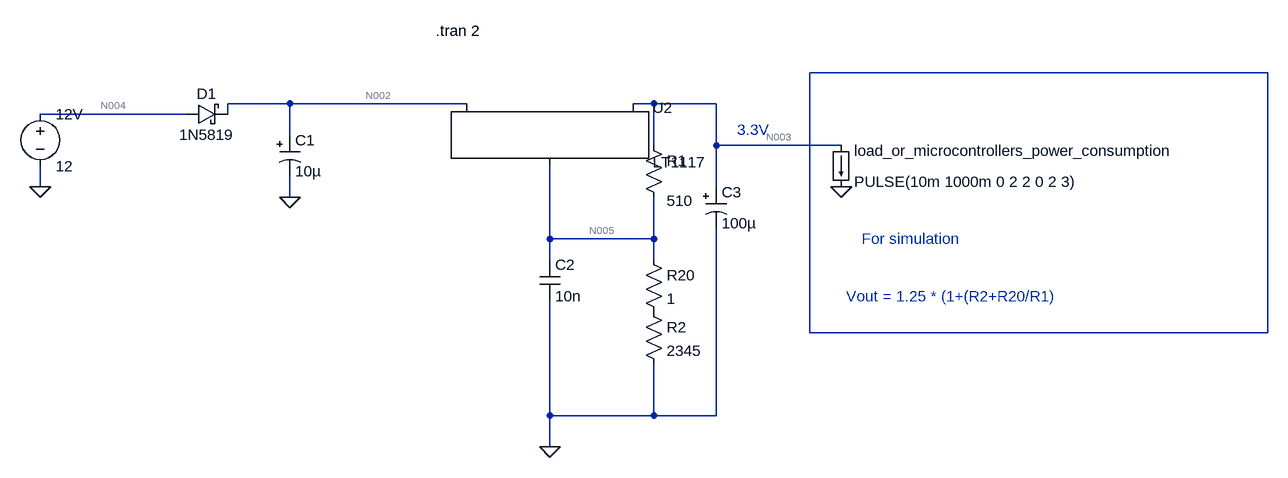
[diagram p0: schematic STM32 power.asc]
STM32 power.asc, the LTspice schematic file:
Version 4
SHEET 1 956 740
WIRE -272 16 -976 16
WIRE -1776 64 -1872 64
WIRE -1504 64 -1776 64
WIRE -1216 64 -1248 64
WIRE -1120 64 -1216 64
WIRE -1936 80 -2160 80
WIRE -1872 80 -1872 64
WIRE -1776 112 -1776 64
WIRE -1216 128 -1216 64
WIRE -1120 128 -1120 64
WIRE -928 128 -1120 128
WIRE -2160 192 -2160 160
WIRE -1120 192 -1120 128
WIRE -1776 208 -1776 176
WIRE -1376 272 -1376 160
WIRE -1216 272 -1216 208
WIRE -1216 272 -1376 272
WIRE -1376 304 -1376 272
WIRE -1216 304 -1216 272
WIRE -976 416 -976 16
WIRE -272 416 -272 16
WIRE -272 416 -976 416
WIRE -1376 544 -1376 368
WIRE -1216 544 -1216 464
WIRE -1216 544 -1376 544
WIRE -1120 544 -1120 256
WIRE -1120 544 -1216 544
WIRE -1376 592 -1376 544
FLAG -1376 592 0
FLAG -2160 192 0
FLAG -928 192 0
FLAG -1776 208 0
SYMBOL PowerProducts\\LT1117 -1376 64 R0
SYMATTR InstName U2
SYMBOL voltage -2160 64 R0
WINDOW 123 0 0 Left 0
WINDOW 39 0 0 Left 0
SYMATTR InstName 12V
SYMATTR Value 12
SYMBOL res -1232 112 R0
WINDOW 3 36 101 Left 2
SYMATTR Value 510
SYMATTR InstName R1
SYMATTR SpiceLine tol=0
SYMBOL cap -1392 304 R0
SYMATTR InstName C2
SYMATTR Value 10n
SYMBOL load -944 128 R0
WINDOW 123 0 0 Left 0
WINDOW 39 0 0 Left 0
SYMATTR InstName load_or_microcontrollers_power_consumption
SYMATTR Value PULSE(10m 1000m 0 2 2 0 2 3)
SYMBOL res -1232 288 R0
SYMATTR InstName R20
SYMATTR Value 1
SYMATTR SpiceLine tol=0
SYMBOL res -1232 368 R0
SYMATTR InstName R2
SYMATTR Value 2345
SYMATTR SpiceLine tol=0
SYMBOL schottky -1936 96 R270
WINDOW 0 32 32 VTop 2
WINDOW 3 0 32 VBottom 2
SYMATTR InstName D1
SYMATTR Value 1N5819
SYMATTR Description Diode
SYMATTR Type diode
SYMBOL polcap -1792 112 R0
WINDOW 3 24 56 Left 2
SYMATTR Value 10µ
SYMATTR InstName C1
SYMATTR Description Capacitor
SYMATTR Type cap
SYMATTR SpiceLine V=16 Irms=540m Rser=0.24 Lser=4.5n
SYMBOL polcap -1136 192 R0
WINDOW 3 24 56 Left 2
SYMATTR Value 100µ
SYMATTR InstName C3
SYMATTR Description Capacitor
SYMATTR Type cap
TEXT -1552 -48 Left 2 !.tran 2
TEXT -896 272 Left 2 ;For simulation
TEXT -1088 104 Left 2 ;3.3V
TEXT -920 360 Left 2 ;Vout = 1.25 * (1+(R2+R20/R1)

The netlist it stands for:
* STM32 power.asc
XU2 N005 N003 N002 LT1117
V§12V N004 0 12
R1 N003 N005 510 tol=0
C2 N005 0 10n
I§load_or_microcontrollers_power_consumption N003 0 PULSE(10m 1000m 0 2 2 0 2 3)
R20 N005 P001 1 tol=0
R2 P001 0 2345 tol=0
D1 N004 N002 1N5819
C1 N002 0 10µ V=16 Irms=540m Rser=0.24 Lser=4.5n
C3 N003 0 100µ
.model D D
.lib standard.dio
.tran 2
* For simulation
* 3.3V
* Vout = 1.25 * (1+(R2+R20/R1)
.lib LT1117.lib
.backanno
.end

* Results of the author's LTspice run, read from the files saved beside the schematic
* Operating Point, zero values left out:
*   V(n002) = 11.79 V
*   V(n005) = 5.922 V
*   V(n003) = 7.182 V
*   V(n004) = 12 V
*   V(p001) = 5.92 V
*   I(D1) = 12.52 mA
*   I(Load_or_microcontrollers_power_consumption) = 10 mA
*   I(R1) = 2.469 mA
*   I(R20) = 2.524 mA
*   I(R2) = 2.524 mA
*   I(12v) = -12.52 mA
*   Ix(u2:1) = -55 µA
*   Ix(u2:2) = -12.47 mA
*   Ix(u2:3) = 12.52 mA
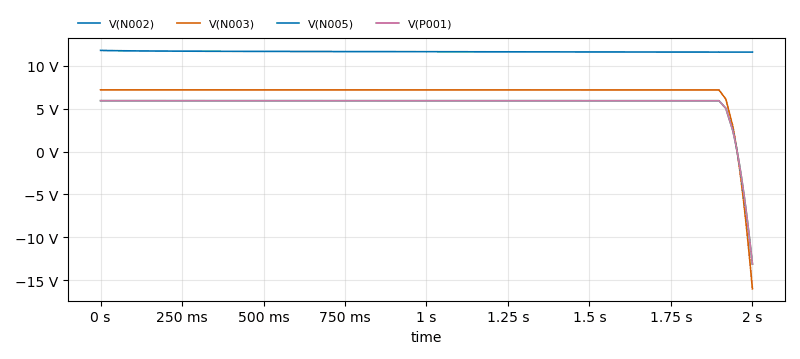
[diagram p1: Transient Analysis of STM32 power.asc, plotted from the saved traces]
* Transient Analysis, 1 run:
*   V(N002): min 11.59 V, max 11.79 V, average 11.64 V, rms 11.64 V, last 11.59 V
*   V(N003): min -16 V, max 7.182 V, average 6.765 V, rms 7.168 V, last -16 V
*   V(N005): min -13.12 V, max 5.922 V, average 5.58 V, rms 5.909 V, last -13.12 V
*   V(P001): min -13.11 V, max 5.92 V, average 5.578 V, rms 5.907 V, last -13.11 V